# Altium schematic sheet Power.SchDoc
size A
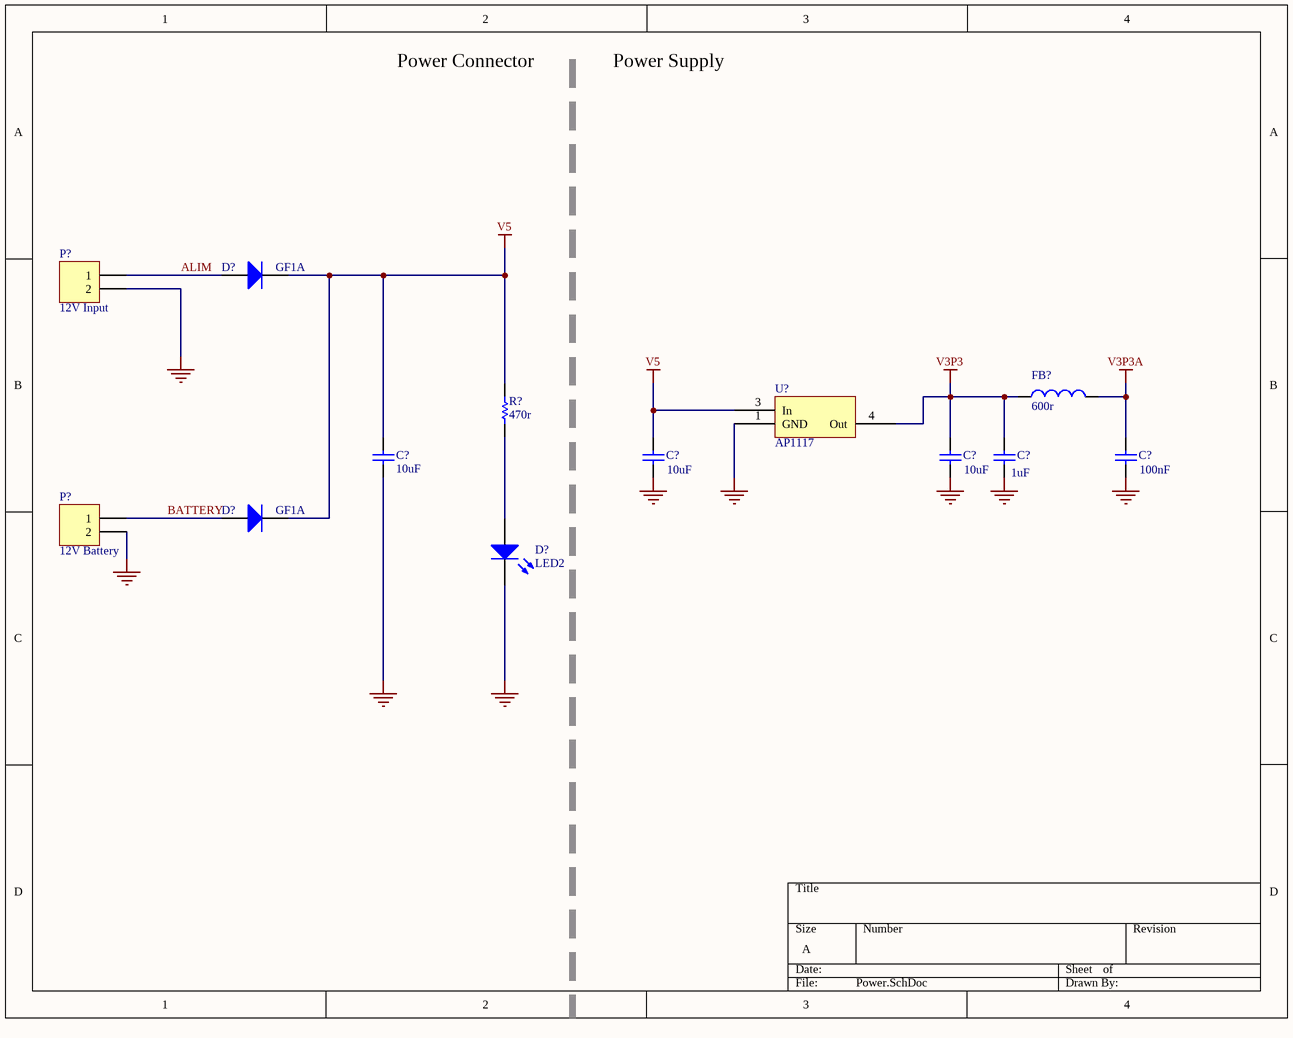
[diagram p0: Power.SchDoc]

## Parts
(Parts that share a designator on the sheet are numbered #1, #2 ... from top to bottom, then left to right.)
C?#1  value 100nF  [RAD-0.3]  (hidden comment: Cap)
C?#2  10uF  [RAD-0.3]
C?#3  value 10uF  [RAD-0.3]  (hidden comment: Cap)
C?#4  value 10uF  [RAD-0.3]  (hidden comment: Cap)
C?#5  value 1uF  [RAD-0.3]  (hidden comment: Cap)
D?#1  GF1A  [SMC]
D?#2  GF1A  [SMC]
D?#3  LED2  [3.2X1.6X1.1]
FB?  600r  [0402-A]
P?#1  12V Input  [HDR1X2]
P?#2  12V Battery  [HDR1X2]
R?  470r  [AXIAL-0.3]
U?  AP1117

## Nets
GND: C?#1.2 C?#2.1 C?#3.1 C?#4.1 C?#5.1 D?#3.2(K) P?#1.2 P?#2.2 U?.1(GND)
V3P3: C?#4.2 C?#5.2 FB?.1 U?.4(Out)
V3P3A: C?#1.1 FB?.2
V5: C?#2.2 C?#3.2 D?#1.2(K) D?#2.2(K) R?.2 U?.3(In)
ALIM: D?#1.1(A) P?#1.1
BATTERY: D?#2.1(A) P?#2.1
NetD?#3_1: D?#3.1(A) R?.1

## Notes on the sheet
- Power Connector
- Power Supply

## Library data of the parts
C?#1 C?#3-C?#5 = Cap: Capacitor; Published: 8-Jun-2000; LatestRevisionDate: 17-Jul-2002; LatestRevisionNote: Re-released for DXP Platform.; PackageReference: RAD-0.3; Publisher: Altium Limited; PackageDescription: Radial Cap, Thru-Hole; 2 Leads; 0.3 in Pin Spacing
C?#2 = Cap: Capacitor; Value: 100pF; Published: 8-Jun-2000; LatestRevisionDate: 17-Jul-2002; LatestRevisionNote: Re-released for DXP Platform.; PackageReference: RAD-0.3; Publisher: Altium Limited; PackageDescription: Radial Cap, Thru-Hole; 2 Leads; 0.3 in Pin Spacing
D?#1 = Diode: Default Diode; Published: 8-Jun-2000; LatestRevisionDate: 17-Jul-2002; LatestRevisionNote: Re-released for DXP Platform.; PackageVersion: Sep-1996; PackageReference: SMC; Publisher: Altium Limited; PackageDescription: DO-214-AB/SMC; 2 C-Bend Leads; Body 7.9 x 5.9 mm, inc. leads (LxW); Code_JEDEC: DO-214-AB
D?#2 = Diode: Published: 8-Jun-2000; LatestRevisionDate: 17-Jul-2002; LatestRevisionNote: Re-released for DXP Platform.; PackageVersion: Sep-1996; PackageReference: SMC; Publisher: Altium Limited; PackageDescription: DO-214-AB/SMC; 2 C-Bend Leads; Body 7.9 x 5.9 mm, inc. leads (LxW); Code_JEDEC: DO-214-AB
D?#3 = LED2: Typical RED, GREEN, YELLOW, AMBER GaAs LED; Published: 8-Jun-2000; LatestRevisionDate: 17-Jul-2002; LatestRevisionNote: Re-released for DXP Platform.; PackageVersion: Feb-2002; PackageReference: 3.2X1.6X1.1; Publisher: Altium Limited; PackageDescription: SM LED; 2 Flat Leads
FB? = Inductor: Code_IEC: 1005; Published: 8-Jun-2000; LatestRevisionDate: 29-May-2009; LatestRevisionNote: IPC-7351 Footprint Added.; PackageReference: 0402-A; Publisher: Altium Limited; PackageDescription: Chip Inductor; Code_JEITA: 0402
P?#1 P?#2 = Header 2: Header, 2-Pin; LatestRevisionDate: 17-Jul-2002; LatestRevisionNote: Re-released for DXP Platform.; Publisher: Altium Limited
R? = Res1: Resistor; Value: 1K; Published: 8-Jun-2000; LatestRevisionDate: 17-Jul-2002; LatestRevisionNote: Re-released for DXP Platform.; PackageReference: AXIAL-0.3; Publisher: Altium Limited; PackageDescription: Axial Device, Thru-Hole; 2 Leads; 0.3 in Pin Spacing